# Altium schematic sheet DCDC.SchDoc
size A4
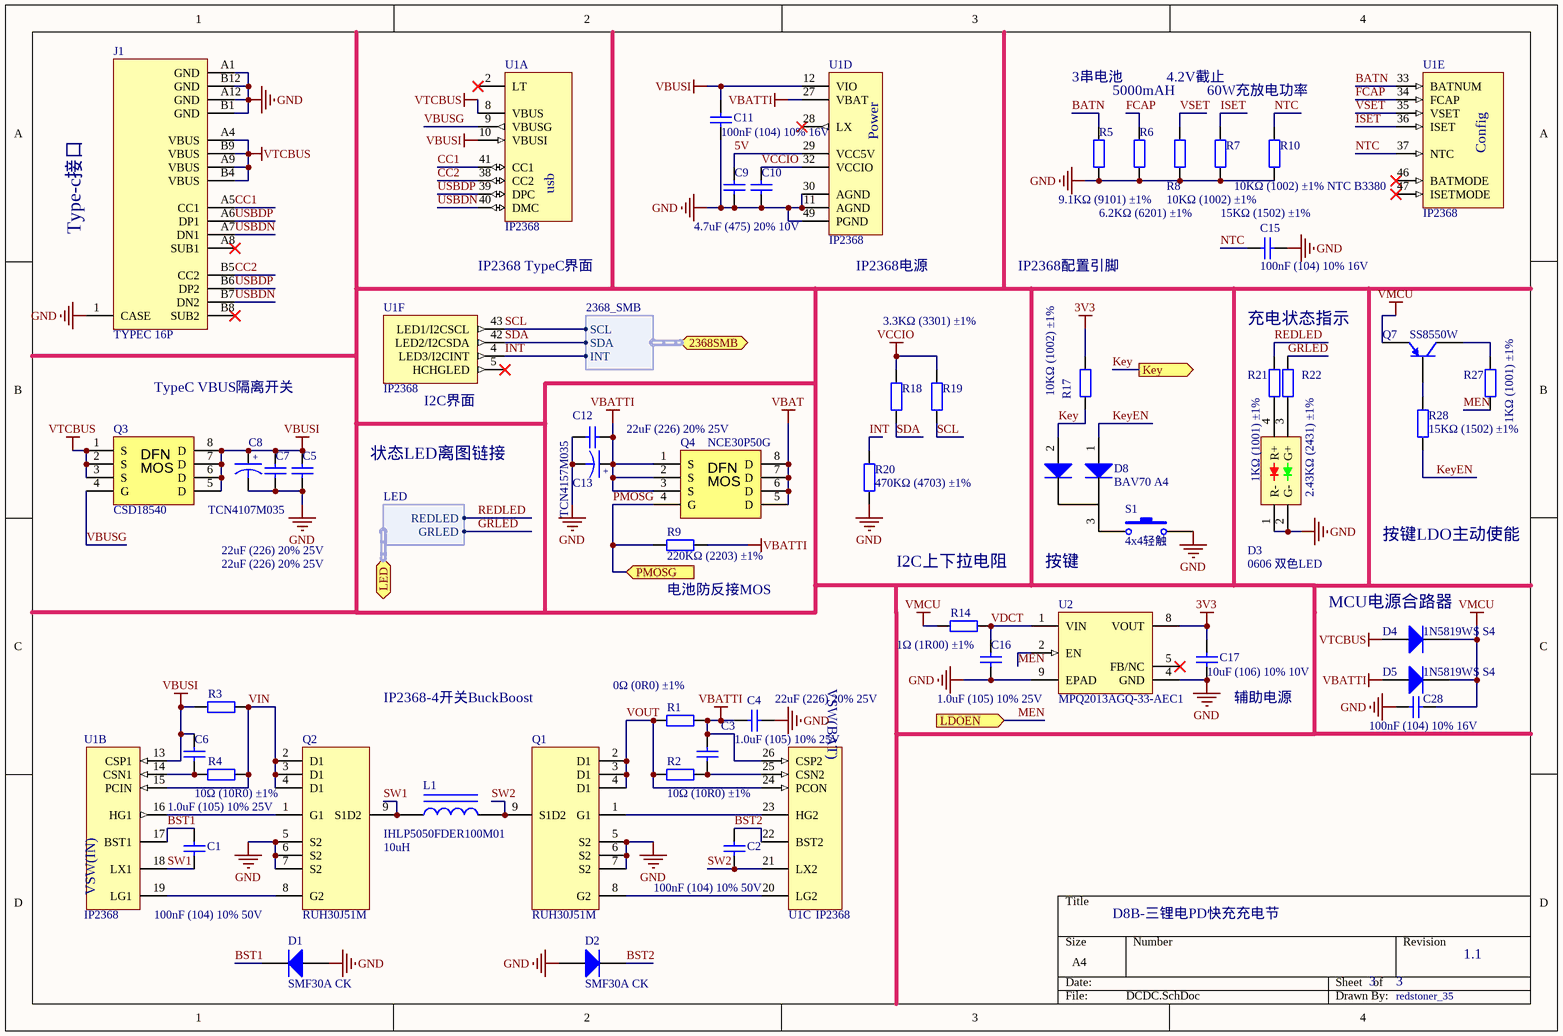
[diagram p0: DCDC.SchDoc]

## Parts
C1  100nF (104) 10% 50V  [0603_C]
C2  100nF (104) 10% 50V  [0603_C]
C3  1.0uF (105) 10% 25V  [0402_C]
C4  22uF (226) 20% 25V  [0805_C]
C5  22uF (226) 20% 25V  [0805_C]
C6  1.0uF (105) 10% 25V  [0402_C]
C7  22uF (226) 20% 25V  [0805_C]
C8  TCN4107M035  [TCN4]
C9  4.7uF (475) 20% 10V  [0402_C]
C10  4.7uF (475) 20% 10V  [0402_C]  (value not drawn)
C11  100nF (104) 10% 16V  [0402_C]
C12  22uF (226) 20% 25V  [0805_C]
C13  TCN4157M035  [TCN4]
C15  100nF (104) 10% 16V  [0402_C]
C16  1.0uF (105) 10% 25V  [0402_C]
C17  10uF (106) 10% 10V  [0603_C]
C28  100nF (104) 10% 16V  [0402_C]
D1  SMF30A CK  [SOD-123]
D2  SMF30A CK  [SOD-123]
D3  0606 双色LED  [LED-SMD_4P-L1.6-W1.5-TL-1]
D4  1N5819WS S4  [SOD-323]
D5  1N5819WS S4  [SOD-323]
D8  BAV70 A4  [SC70-3]
J1  TYPEC 16P  [USB-C-SMD_KH-TYPE-C-16P]
L1  IHLP5050FDER100M01  value 10uH  [IHLP5050FDER***M01]
Q1  RUH30J51M  [PDFN-8_L5.8-W4.9_RU30J30M]
Q2  RUH30J51M  [PDFN-8_L5.8-W4.9_RU30J30M]
Q3  CSD18540  [SON/DFN5x6(MOS)]
Q4  NCE30P50G  [SON/DFN5x6(MOS)]
Q7  SS8550W  [SC70-3]
R1  0Ω (0R0) ±1%  [1206_R]
R2  10Ω (10R0) ±1%  [0402_R]
R3  0Ω (0R0) ±1%  [1206_R]  (value not drawn)
R4  10Ω (10R0) ±1%  [0402_R]
R5  9.1KΩ (9101) ±1%  [0402_R]
R6  6.2KΩ (6201) ±1%  [0402_R]
R7  15KΩ (1502) ±1%  [0402_R]
R8  10KΩ (1002) ±1%  [0402_R]
R9  220KΩ (2203) ±1%  [0402_R]
R10  10KΩ (1002) ±1% NTC B3380  [0402_R]
R14  1Ω (1R00) ±1%  [0402_R]
R17  10KΩ (1002) ±1%  [0402_R]
R18  3.3KΩ (3301) ±1%  [0402_R]  (value not drawn)
R19  3.3KΩ (3301) ±1%  [0402_R]
R20  470KΩ (4703) ±1%  [0402_R]
R21  1KΩ (1001) ±1%  [0402_R]
R22  2.43KΩ (2431) ±1%  [0402_R]
R27  1KΩ (1001) ±1%  [0402_R]
R28  15KΩ (1502) ±1%  [0402_R]
S1  4x4轻触  [SW-SMD_4P-L5.2-W5.2-P3.70-LS6.4]
U1  IP2368  [QFN50P700X700X100_HS-49M]  (parts A,B,C,D,E,F of 6)
U2  MPQ2013AGQ-33-AEC1  [MPQ2013A-QFN8]

## Ports
2368SMB (harness 2368_SMB), Key (out), LDOEN (in), LED (harness LED), PMOSG (in)

## Harnesses
2368_SMB: SCL, SDA, INT
LED: REDLED, GRLED

## Nets
3V3: C17.2 R17.2 U2.8(VOUT)
GND: C4.2 C5.1 C7.1 C8.2 C9.1 C10.1 C11.1 C12.2 C13.2 C15.2 C16.1 C17.1 C28.1 D1.1(A) D2.1(A) D3.1(R-) D3.2(G-) J1.1(CASE) J1.A1(GND) J1.A12(GND) J1.B1(GND) J1.B12(GND) Q1.5(S2) Q1.6(S2) Q1.7(S2) Q2.5(S2) Q2.6(S2) Q2.7(S2) R5.1 R6.1 R7.1 R8.1 R10.1 R20.1 S1.2 U1.11(AGND) U1.30(AGND) U1.49(PGND) U2.4(GND) U2.9(EPAD)
VBAT: Q4.5(D) Q4.6(D) Q4.7(D) Q4.8(D)
VBATTI: C3.2 C4.1 C12.1 C13.1 D5.1(A) Q4.1(S) Q4.2(S) Q4.3(S) R1.2 R9.2 U1.26(CSP2) U1.27(VBAT)
VBUSI: C5.2 C6.2 C7.2 C8.1 C11.2 Q3.5(D) Q3.6(D) Q3.7(D) Q3.8(D) R3.1 U1.10(VBUSI) U1.12(VIO) U1.13(CSP1)
VCCIO: C10.2 R18.2 R19.2 U1.32(VCCIO)
VMCU: C28.2 D4.2(K) D5.2(K) Q7.2(E) R14.1
VTCBUS: D4.1(A) J1.A4(VBUS) J1.A9(VBUS) J1.B4(VBUS) J1.B9(VBUS) Q3.1(S) Q3.2(S) Q3.3(S) U1.8(VBUS)
5V: C9.2 U1.29(VCC5V)
BATN: R5.2 U1.33(BATNUM)
BST1: C1.2 D1.2(K) U1.17(BST1)
BST2: C2.2 D2.2(K) U1.22(BST2)
CC1: J1.A5(CC1) U1.41(CC1)
CC2: J1.B5(CC2) U1.38(CC2)
FCAP: R6.2 U1.34(FCAP)
GRLED: R22.1 ; port LED.GRLED
INT: R20.2 U1.4(LED3/I2CINT) ; port 2368SMB.INT
ISET: R7.2 U1.36(ISET)
Key: D8.2(A) R17.1 ; port Key
KeyEN: D8.1(A) R28.1
MEN: R27.1 U2.2(EN) ; port LDOEN
NTC: C15.1 R10.2 U1.37(NTC)
PMOSG: Q4.4(G) R9.1 ; port PMOSG
REDLED: R21.2 ; port LED.REDLED
SCL: R19.1 U1.43(LED1/I2CSCL) ; port 2368SMB.SCL
SDA: R18.1 U1.42(LED2/I2CSDA) ; port 2368SMB.SDA
SW1: C1.1 L1.1 Q2.9(S1D2) U1.18(LX1)
SW2: C2.1 L1.2 Q1.9(S1D2) U1.21(LX2)
USBDN: J1.A7(DN1) J1.B7(DN2) U1.40(DMC)
USBDP: J1.A6(DP1) J1.B6(DP2) U1.39(DPC)
VBUSG: Q3.4(G) U1.9(VBUSG)
VDCT: C16.2 R14.2 U2.1(VIN)
VIN: Q2.2(D1) Q2.3(D1) Q2.4(D1) R3.2 R4.2 U1.15(PCIN)
VOUT: Q1.2(D1) Q1.3(D1) Q1.4(D1) R1.1 R2.1 U1.24(PCON)
VSET: R8.2 U1.35(VSET)
NetC3_1: C3.1 R2.2 U1.25(CSN2)
NetC6_1: C6.1 R4.1 U1.14(CSN1)
NetD3_3: D3.3(G+) R22.2
NetD3_4: D3.4(R+) R21.1
NetD8_3: D8.3(K) S1.1
NetQ1_1: Q1.1(G1) U1.23(HG2)
NetQ1_8: Q1.8(G2) U1.20(LG2)
NetQ2_1: Q2.1(G1) U1.16(HG1)
NetQ2_8: Q2.8(G2) U1.19(LG1)
NetQ7_1: Q7.1(B) R28.2
NetQ7_3: Q7.3(C) R27.2

Not connected (* = marked no-connect by the designer): J1 A8(SUB1)* B8(SUB2)*; U1 2(LT)* 5(HCHGLED)* 28(LX)* 46(BATMODE)* 47(ISETMODE)*; U2 5(FB/NC)*

## Notes on the sheet
- 3串电池
- 5000mAH
- 4.2V截止
- 60W充放电功率
- (near J1) Type-c接口
- (near U1) IP2368 TypeC界面
- (near U1) IP2368电源
- IP2368配置引脚
- 充电状态指示
- TypeC VBUS隔离开关
- (near U1) I2C界面
- 状态LED离图链接
- I2C上下拉电阻
- 按键
- 按键LDO主动使能
- (near R9) 电池防反接MOS
- (near D4) MCU电源合路器
- IP2368-4开关BuckBoost
- (near C17) 辅助电源
- D8B-三锂电PD快充充电节
- 3
- 1.1
- redstoner_35
- (in symbol CAP2) +
- (in symbol IP2368, part A) usb
- (in symbol IP2368, part B) VSW(IN)
- (in symbol IP2368, part C) VSW(BAT)
- (in symbol IP2368, part D) Power
- (in symbol IP2368, part E) Config
- (in symbol SON/DFN5x6 MOS) DFN; MOS

## Library data of the parts
C1 C2 = 0603 100nF (104) 10% 50V: 贴片电容; ComponentLink1Description: 供应商链接; ComponentLink1URL: http://www.szlcsc.com/product/details_15331.html; Package: 0603; Supplier: LC; SuppliersPartNumber: C14663
C3 C6 C16 = 0402 1.0uF (105) 10% 25V: 贴片电容; ComponentLink1Description: 供应商链接; ComponentLink1URL: http://www.szlcsc.com/product/details_53938.html; Package: 0402; Supplier: LC; SuppliersPartNumber: C52923
C4 C5 C7 C12 = 0805 22uF (226) 20% 25V: 贴片电容; ComponentLink1Description: 供应商链接; ComponentLink1URL: http://www.szlcsc.com/product/details_46786.html; Package: 0805; Supplier: LC; SuppliersPartNumber: C45783
C8 C13 = CAP2: Capacitor
C9 C10 = 0402 4.7uF (475) 20% 10V: 贴片电容; ComponentLink1Description: 供应商链接; ComponentLink1URL: http://www.szlcsc.com/product/details_24469.html; Package: 0402; Supplier: LC; SuppliersPartNumber: C23733
C11 C15 C28 = 0402 100nF (104) 10% 16V: 贴片电容; ComponentLink1Description: 供应商链接; ComponentLink1URL: http://www.szlcsc.com/product/details_1877.html; Package: 0402; Supplier: LC; SuppliersPartNumber: C1525
C17 = 0603 10uF (106) 10% 10V: 贴片电容; ComponentLink1Description: 供应商链接; ComponentLink1URL: http://www.szlcsc.com/product/details_20411.html; Package: 0603; Supplier: LC; SuppliersPartNumber: C19702
D1 D2 = SOD-123 B5819W  SL: TVS二极管; ComponentLink1Description: 供应商链接; ComponentLink1URL: http://www.szlcsc.com/product/details_9093.html; Package: SOD-123; Supplier: LC; SuppliersPartNumber: C??????
D3 = 0606DualColor LED: 0606 双色LED 红色/翠绿
D4 D5 = SOD-323 1N4148WS T4: 二极管; ComponentLink1Description: 供应商链接; ComponentLink1URL: http://www.szlcsc.com/product/details_2485.html; Package: SOD-323; Supplier: LC; SuppliersPartNumber: C??????
D8 = SOT-23 BAV70 A4: 开关二极管; ComponentLink1Description: 供应商链接; ComponentLink1URL: http://www.szlcsc.com/product/details_70091.html; Package: SOT-23; Supplier: LC; SuppliersPartNumber: C68978
J1 = KH-TYPEC-16P: 16Pin TypeC立贴座子
L1 = Inductor Iron: Vishay Inductor 10uH 16.4mR 15.5A; Published: 24-Mar-1999; LatestRevisionDate: 17-Jul-2002; LatestRevisionNote: Re-released for DXP Platform.; PackageReference: AXIAL-0.9; Publisher: Altium Limited; PackageDescription: Axial Device, Thru-Hole; 2 Leads; 0.9 in Pin Spacing
Q1 Q2 = RU30J30M: Dual N MOSFET 30V/51A
Q3 Q4 = SON/DFN5x6 MOS: Gerenal DFN/SON Package MOSFET
Q7 = SOT-23 SS8550 Y2: 三极管; ComponentLink1Description: 供应商链接; ComponentLink1URL: http://www.szlcsc.com/product/details_9037.html; Package: SOT-23; Supplier: LC; SuppliersPartNumber: C8542
R1 R3 = 1206 0Ω (0R0) 1%: 贴片电阻; ComponentLink1Description: 供应商链接; ComponentLink1URL: http://www.szlcsc.com/product/details_18576.html; Package: 1206; Supplier: LC; SuppliersPartNumber: C17888
R2 R4 = 0402 10Ω (10R0) 1%: 贴片电阻; ComponentLink1Description: 供应商链接; ComponentLink1URL: http://www.szlcsc.com/product/details_25820.html; Package: 0402; Supplier: LC; SuppliersPartNumber: C25077
R5 R6 = 0402 0Ω (0R0) 1%: 贴片电阻; ComponentLink1Description: 供应商链接; ComponentLink1URL: http://www.szlcsc.com/product/details_17853.html; Package: 0402; Supplier: LC; SuppliersPartNumber: C17168
R7 R28 = 0402 15KΩ (1502) 1%: 贴片电阻; ComponentLink1Description: 供应商链接; ComponentLink1URL: http://www.szlcsc.com/product/details_26499.html; Package: 0402; Supplier: LC; SuppliersPartNumber: C25756
R8 R17 = 0402 10KΩ (1002) 1%: 贴片电阻; ComponentLink1Description: 供应商链接; ComponentLink1URL: http://www.szlcsc.com/product/details_26487.html; Package: 0402; Supplier: LC; SuppliersPartNumber: C25744
R9 = 0402 220KΩ (2203) 1%: 贴片电阻; ComponentLink1Description: 供应商链接; ComponentLink1URL: http://www.szlcsc.com/product/details_26510.html; Package: 0402; Supplier: LC; SuppliersPartNumber: C25767
R10 = 0402 10KΩ (1002) 1%: 贴片NTC热敏电阻; ComponentLink1Description: 供应商链接; ComponentLink1URL: http://www.szlcsc.com/product/details_26487.html; Package: 0402; Supplier: LC; SuppliersPartNumber: C???????????
R14 = 0402 1Ω (1R00) 1%: 贴片电阻; ComponentLink1Description: 供应商链接; ComponentLink1URL: http://www.szlcsc.com/product/details_25829.html; Package: 0402; Supplier: LC; SuppliersPartNumber: C25086
R18 R19 = 0402 3.3KΩ (3301) 1%: 贴片电阻; ComponentLink1Description: 供应商链接; ComponentLink1URL: http://www.szlcsc.com/product/details_26633.html; Package: 0402; Supplier: LC; SuppliersPartNumber: C25890
R20 = 0402 470KΩ (4703) 1%: 贴片电阻; ComponentLink1Description: 供应商链接; ComponentLink1URL: http://www.szlcsc.com/product/details_26533.html; Package: 0402; Supplier: LC; SuppliersPartNumber: C25790
R21 R27 = 0402 1KΩ (1001) 1%: 贴片电阻; ComponentLink1Description: 供应商链接; ComponentLink1URL: http://www.szlcsc.com/product/details_12256.html; Package: 0402; Supplier: LC; SuppliersPartNumber: C11702
R22 = 0402 2KΩ (2001) 1%: 贴片电阻; ComponentLink1Description: 供应商链接; ComponentLink1URL: http://www.szlcsc.com/product/details_4516.html; Package: 0402; Supplier: LC; SuppliersPartNumber: C????????
S1 = SW-PB: Switch; pin to pad: 2>3; Published: 24-Mar-1999; LatestRevisionDate: 17-Jul-2002; LatestRevisionNote: Re-released for DXP Platform.; PackageReference: SPST-2; Publisher: Altium Limited; PackageDescription: Switch; 2 Leads
U1 = IP2368: IP2368 2-5S 双向电池充放电管理，100W PD
U2 = MPQ2013AGQ-xx-AEC1: MPS 40V LDO with Enable pin QFN3x3 package